# Altium schematic sheet UART_USB_POWER.SchDoc
size B; SheetNumber: 5; SheetTotal: 8
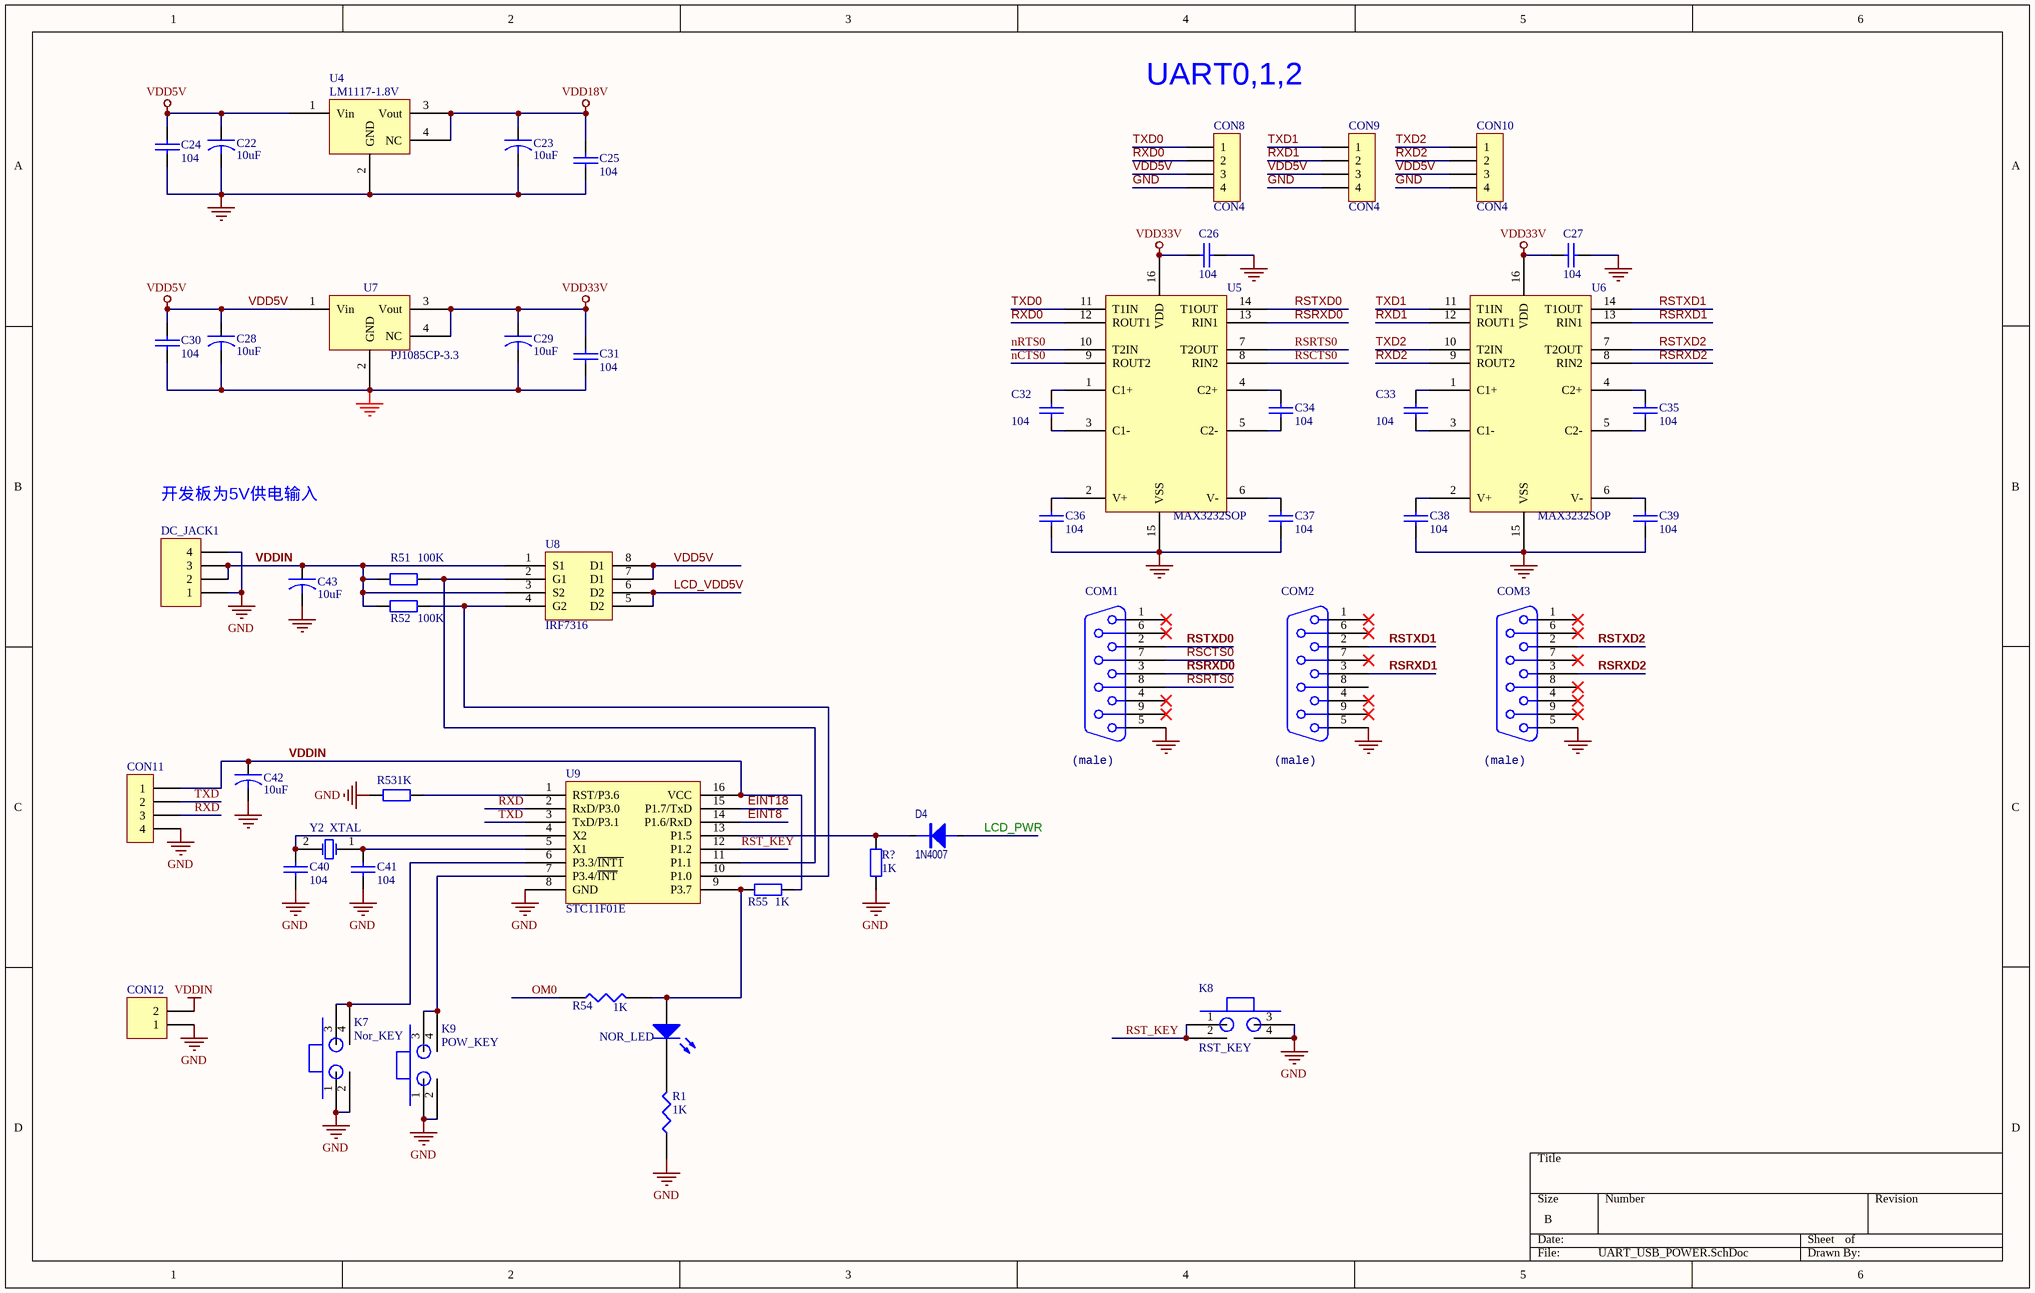
[diagram p0: UART_USB_POWER.SchDoc]

## Parts
C22  10uF  [3216A]
C23  10uF  [3216A]
C24  104  [0603A]
C25  104  [0603A]
C26  104  [0603A]
C27  104  [0603A]
C28  10uF  [3216A]
C29  10uF  [3216A]
C30  104  [0603A]
C31  104  [0603A]
C32  104  [0603A]
C33  104  [0603A]
C34  104  [0603A]
C35  104  [0603A]
C36  104  [0603A]
C37  104  [0603A]
C38  104  [0603A]
C39  104  [0603A]
C40  104  [0603A]
C41  104  [0603A]
C42  10uF  [3216A]
C43  10uF  [3216A]
COM1  (no value)  [DB9RA/M]
COM2  (no value)  [DB9RA/M]
COM3  (no value)  [DB9RA/M]
CON8  CON4  [SIP4-FA2]
CON9  CON4  [SIP4-FA2]
CON10  CON4  [SIP4-FA2]
CON11  CON4  [SIP4-FA2]  (value not drawn)
CON12  CON12  [SIP2-FA2]  (value not drawn)
D4  1N4007  [D1206]
DC_JACK1  Header 4  [DC-33]  (value not drawn)
K7  Nor_KEY  [KEY-4]
K8  RST_KEY  [KEY-4]
K9  POW_KEY  [KEY-4]
NOR_LED1  NOR_LED  [LED]
R1  1K  [0603R]
R51  100K  [0603A]
R52  100K  [0603A]
R53  value 1K  [0603R]  (hidden comment: 10K)
R54  1K  [0603R]
R55  1K  [0603R]
R?  1K  [0603R]
U4  LM1117-1.8V  [TO-252]
U5  MAX3232SOP  [SSOP16]
U6  MAX3232SOP  [SSOP16]
U7  PJ1085CP-3.3  [TO-252]
U8  IRF7316  [SOP8-50-160]
U9  STC11F01E  [SSOP16]
Y2  XTAL  [OSC2PR-1]

## Nets
GND: C22.2 C23.2 C24.2 C25.2 C26.2 C27.2 C28.2 C29.2 C30.2 C31.2 C36.2 C37.2 C38.2 C39.2 C40.2 C41.2 C42.2 C43.2 COM1.5 COM2.5 COM3.5 CON8.4 CON9.4 CON10.4 CON11.4 CON12.1 DC_JACK1.1 DC_JACK1.4 K7.1 K7.2 K8.3 K8.4 K9.1 K9.2 R1.1 R53.1 R?.1 U4.2(GND) U5.15(VSS) U6.15(VSS) U7.2(GND) U9.8(GND)
VDD5V: C22.1 C24.1 C28.1 C30.1 CON8.3 CON9.3 CON10.3 U4.1(Vin) U7.1(Vin) U8.7(D1) U8.8(D1)
VDD18V: C23.1 C25.1 U4.3(Vout) U4.4(NC)
VDD33V: C26.1 C27.1 C29.1 C31.1 U5.16(VDD) U6.16(VDD) U7.3(Vout) U7.4(NC)
VDDIN: C42.1 C43.1 CON11.1 CON12.2 DC_JACK1.2 DC_JACK1.3 R51.2 R52.2 R55.2 U8.1(S1) U8.3(S2) U9.16(VCC)
EINT8: U9.14(P1.6/RxD)
EINT18: U9.15(P1.7/TxD)
LCD_PWR: D4.1
LCD_VDD5V: U8.5(D2) U8.6(D2)
nCTS0: U5.9(ROUT2)
nRTS0: U5.10(T2IN)
OM0: R54.1
RSCTS0: COM1.7 U5.8(RIN2)
RSRTS0: COM1.8 U5.7(T2OUT)
RSRXD0: COM1.3 U5.13(RIN1)
RSRXD1: COM2.3 U6.13(RIN1)
RSRXD2: COM3.3 U6.8(RIN2)
RST_KEY: K8.1 K8.2 U9.12(P1.2)
RSTXD0: COM1.2 U5.14(T1OUT)
RSTXD1: COM2.2 U6.14(T1OUT)
RSTXD2: COM3.2 U6.7(T2OUT)
RXD: CON11.3 U9.2(RxD/P3.0)
RXD0: CON8.2 U5.12(ROUT1)
RXD1: CON9.2 U6.12(ROUT1)
RXD2: CON10.2 U6.9(ROUT2)
TXD: CON11.2 U9.3(TxD/P3.1)
TXD0: CON8.1 U5.11(T1IN)
TXD1: CON9.1 U6.11(T1IN)
TXD2: CON10.1 U6.10(T2IN)
NetC32_1: C32.1 U5.1(C1+)
NetC32_2: C32.2 U5.3(C1-)
NetC33_1: C33.1 U6.1(C1+)
NetC33_2: C33.2 U6.3(C1-)
NetC34_1: C34.1 U5.4(C2+)
NetC34_2: C34.2 U5.5(C2-)
NetC35_1: C35.1 U6.4(C2+)
NetC35_2: C35.2 U6.5(C2-)
NetC36_1: C36.1 U5.2(V+)
NetC37_1: C37.1 U5.6(V-)
NetC38_1: C38.1 U6.2(V+)
NetC39_1: C39.1 U6.6(V-)
NetC40_1: C40.1 U9.4(X2) Y2.2(OSC2)
NetC41_1: C41.1 U9.5(X1) Y2.1(OSC1)
NetD4_2: D4.2 R?.2 U9.13(P1.5)
NetK7_3: K7.3 K7.4 U9.6(P3.3/~{INT1})
NetK9_3: K9.3 K9.4 U9.7(P3.4/~{INT})
NetNOR_LED1_1: NOR_LED1.1(A) R54.2 R55.1 U9.9(P3.7)
NetNOR_LED1_2: NOR_LED1.2(K) R1.2
NetR51_1: R51.1 U8.2(G1) U9.11(P1.1)
NetR52_1: R52.1 U8.4(G2) U9.10(P1.0)
NetR53_2: R53.2 U9.1(RST/P3.6)

Not connected (* = marked no-connect by the designer): COM1 1* 4* 6* 9*; COM2 1* 4* 6* 7* 8 9*; COM3 1* 4* 6* 7* 8* 9*

## Notes on the sheet
- UART0,1,2
- (near DC_JACK1) 开发板为5V供电输入
- (near COM1) (male)
- (near COM2) (male)
- (near COM3) (male)

## Library data of the parts
C22 C23 C28 C29 C42 C43 = CAPACITOR
C24 C25 C30 C31 = CAP: Capacitor
C26 C27 C32-C41 = CAP
COM1-COM3 = CONNECTOR DB9: Text Field1: 30; Text Field2: 100
CON8-CON11 = CON4: Connector
CON12 = Header 2H: Header, 2-Pin, Right Angle; LatestRevisionDate: 17-Jul-2002; LatestRevisionNote: Re-released for DXP Platform.; Publisher: Altium Limited
D4 = DIODE
DC_JACK1 = Header 4: Header, 4-Pin; LatestRevisionDate: 17-Jul-2002; LatestRevisionNote: Re-released for DXP Platform.; Publisher: Altium Limited
K7-K9 = PUSHSW
NOR_LED1 = LED0: Typical INFRARED GaAs LED; Published: 8-Jun-2000; LatestRevisionDate: 08-Jul-2005; LatestRevisionNote: Mech Layer 1 removed.; PackageReference: LED-0; Publisher: Altium Limited
R1 R54 = RES1
R51-R53 R55 R? = Res2: Resistor; Published: 8-Jun-2000; LatestRevisionDate: 17-Jul-2002; LatestRevisionNote: Re-released for DXP Platform.; PackageReference: AXIAL-0.4; Publisher: Altium Limited
  R51 R52: Value: 100K
  R55 R?: Value: 1K
U4 U7 = LM1117-33
U5 U6 = MAX232SOP
U9 = STC11F02E
Y2 = XTAL: Crystal Oscillator; Published: 8-Jun-2000; LatestRevisionDate: 17-Jul-2002; LatestRevisionNote: Re-released for DXP Platform.; PackageReference: R38; Publisher: Altium Limited